# Altium schematic sheet MOTOR.SchDoc
size A4
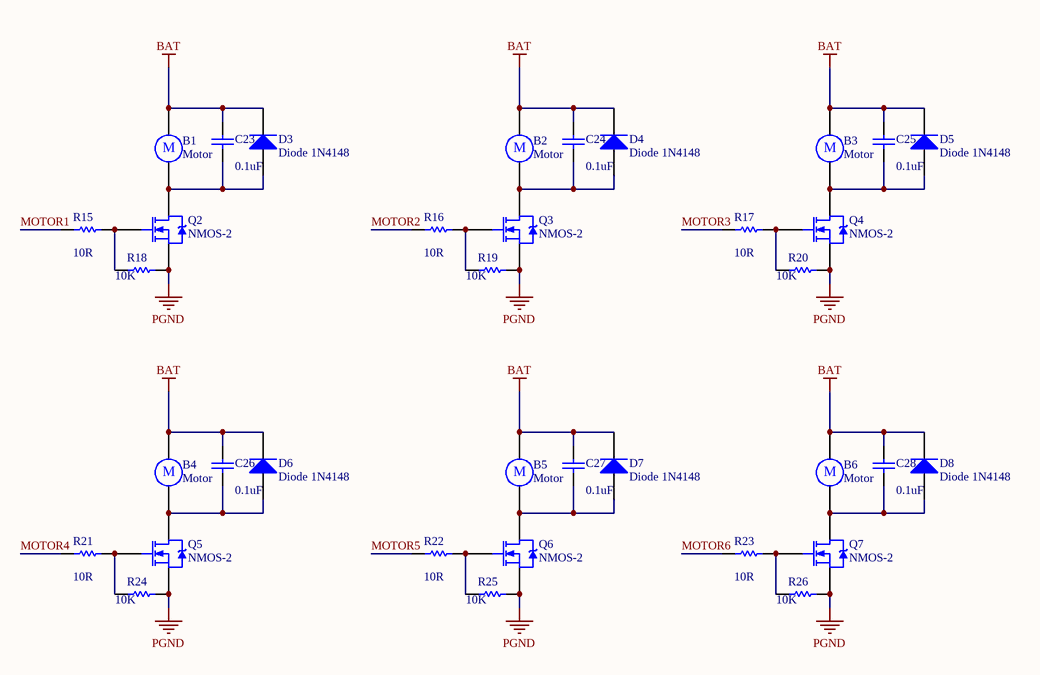
[diagram p0: MOTOR.SchDoc]

## Parts
B1  Motor  [MOTORPAD1]
B2  Motor  [MOTORPAD1]
B3  Motor  [MOTORPAD1]
B4  Motor  [MOTORPAD1]
B5  Motor  [MOTORPAD1]
B6  Motor  [MOTORPAD1]
C23  value 0.1uF  [c0603]  (hidden comment: Cap)
C24  value 0.1uF  [c0603]  (hidden comment: Cap)
C25  value 0.1uF  [c0603]  (hidden comment: Cap)
C26  value 0.1uF  [c0603]  (hidden comment: Cap)
C27  value 0.1uF  [c0603]  (hidden comment: Cap)
C28  value 0.1uF  [c0603]  (hidden comment: Cap)
D3  Diode 1N4148  [SOD-523]
D4  Diode 1N4148  [SOD-523]
D5  Diode 1N4148  [SOD-523]
D6  Diode 1N4148  [SOD-523]
D7  Diode 1N4148  [SOD-523]
D8  Diode 1N4148  [SOD-523]
Q2  NMOS-2  [WDFN8 3.3*3.3,0.65P]
Q3  NMOS-2  [WDFN8 3.3*3.3,0.65P]
Q4  NMOS-2  [WDFN8 3.3*3.3,0.65P]
Q5  NMOS-2  [WDFN8 3.3*3.3,0.65P]
Q6  NMOS-2  [WDFN8 3.3*3.3,0.65P]
Q7  NMOS-2  [WDFN8 3.3*3.3,0.65P]
R15  value 10R  [R0402]  (hidden comment: Res1)
R16  value 10R  [R0402]  (hidden comment: Res1)
R17  value 10R  [R0402]  (hidden comment: Res1)
R18  value 10K  [R0402]  (hidden comment: Res1)
R19  value 10K  [R0402]  (hidden comment: Res1)
R20  value 10K  [R0402]  (hidden comment: Res1)
R21  value 10R  [R0402]  (hidden comment: Res1)
R22  value 10R  [R0402]  (hidden comment: Res1)
R23  value 10R  [R0402]  (hidden comment: Res1)
R24  value 10K  [R0402]  (hidden comment: Res1)
R25  value 10K  [R0402]  (hidden comment: Res1)
R26  value 10K  [R0402]  (hidden comment: Res1)

## Nets
BAT: B1.1 B2.1 B3.1 B4.1 B5.1 B6.1 C23.2 C24.2 C25.2 C26.2 C27.2 C28.2 D3.2(K) D4.2(K) D5.2(K) D6.2(K) D7.2(K) D8.2(K)
PGND: Q2.2(S) Q3.2(S) Q4.2(S) Q5.2(S) Q6.2(S) Q7.2(S) R18.2 R19.2 R20.2 R24.2 R25.2 R26.2
MOTOR1: R15.1
MOTOR2: R16.1
MOTOR3: R17.1
MOTOR4: R21.1
MOTOR5: R22.1
MOTOR6: R23.1
NetB1_2: B1.2 C23.1 D3.1(A) Q2.3(D)
NetB2_2: B2.2 C24.1 D4.1(A) Q3.3(D)
NetB3_2: B3.2 C25.1 D5.1(A) Q4.3(D)
NetB4_2: B4.2 C26.1 D6.1(A) Q5.3(D)
NetB5_2: B5.2 C27.1 D7.1(A) Q6.3(D)
NetB6_2: B6.2 C28.1 D8.1(A) Q7.3(D)
NetQ2_1: Q2.1(G) R15.2 R18.1
NetQ3_1: Q3.1(G) R16.2 R19.1
NetQ4_1: Q4.1(G) R17.2 R20.1
NetQ5_1: Q5.1(G) R21.2 R24.1
NetQ6_1: Q6.1(G) R22.2 R25.1
NetQ7_1: Q7.1(G) R23.2 R26.1

## Notes on the sheet
- (in symbol Motor) M

## Library data of the parts
B1-B6 = Motor: Motor, General Kind; Published: 24-Mar-1999; LatestRevisionDate: 17-Jul-2002; LatestRevisionNote: Re-released for DXP Platform.; PackageReference: RB5-10.5; Publisher: Altium Limited
C23-C28 = Cap: Capacitor; Published: 8-Jun-2000; LatestRevisionDate: 17-Jul-2002; LatestRevisionNote: Re-released for DXP Platform.; PackageReference: RAD-0.3; Publisher: Altium Limited
D3-D8 = Diode 1N4148: High Conductance Fast Diode; Published: 8-Jun-2000; LatestRevisionDate: 17-Jul-2002; LatestRevisionNote: Re-released for DXP Platform.; DatasheetDocument: 1997; PackageReference: DO-35; Publisher: Altium Limited; Code_JEDEC: DO-204-AH; ComponentLink1Description: Manufacturer Link; ComponentLink1URL: http://www.fairchildsemi.com/; ComponentLink2Description: Datasheet; ComponentLink2URL: http://www.fairchildsemi.com/ds/1N%2F1N4148.pdf
Q2-Q7 = NMOS-2: N-Channel Power MOSFET; Note: Pin 2 is electrically connected to pin 4.; Published: 8-Jun-2000; LatestRevisionDate: 17-Jul-2002; LatestRevisionNote: Re-released for DXP Platform.; DatasheetDocument: PD-9.814; PackageReference: TO-220AB; Publisher: Altium Limited; Code_JEDEC: TO-220-AB; ComponentLink1Description: Manufacturer Link; ComponentLink1URL: http://www.irf.com/
R15-R26 = Res1: Resistor; Published: 8-Jun-2000; LatestRevisionDate: 17-Jul-2002; LatestRevisionNote: Re-released for DXP Platform.; PackageReference: AXIAL-0.3; Publisher: Altium Limited